# EAGLE design XBee_Shield (EAGLE 5.01)
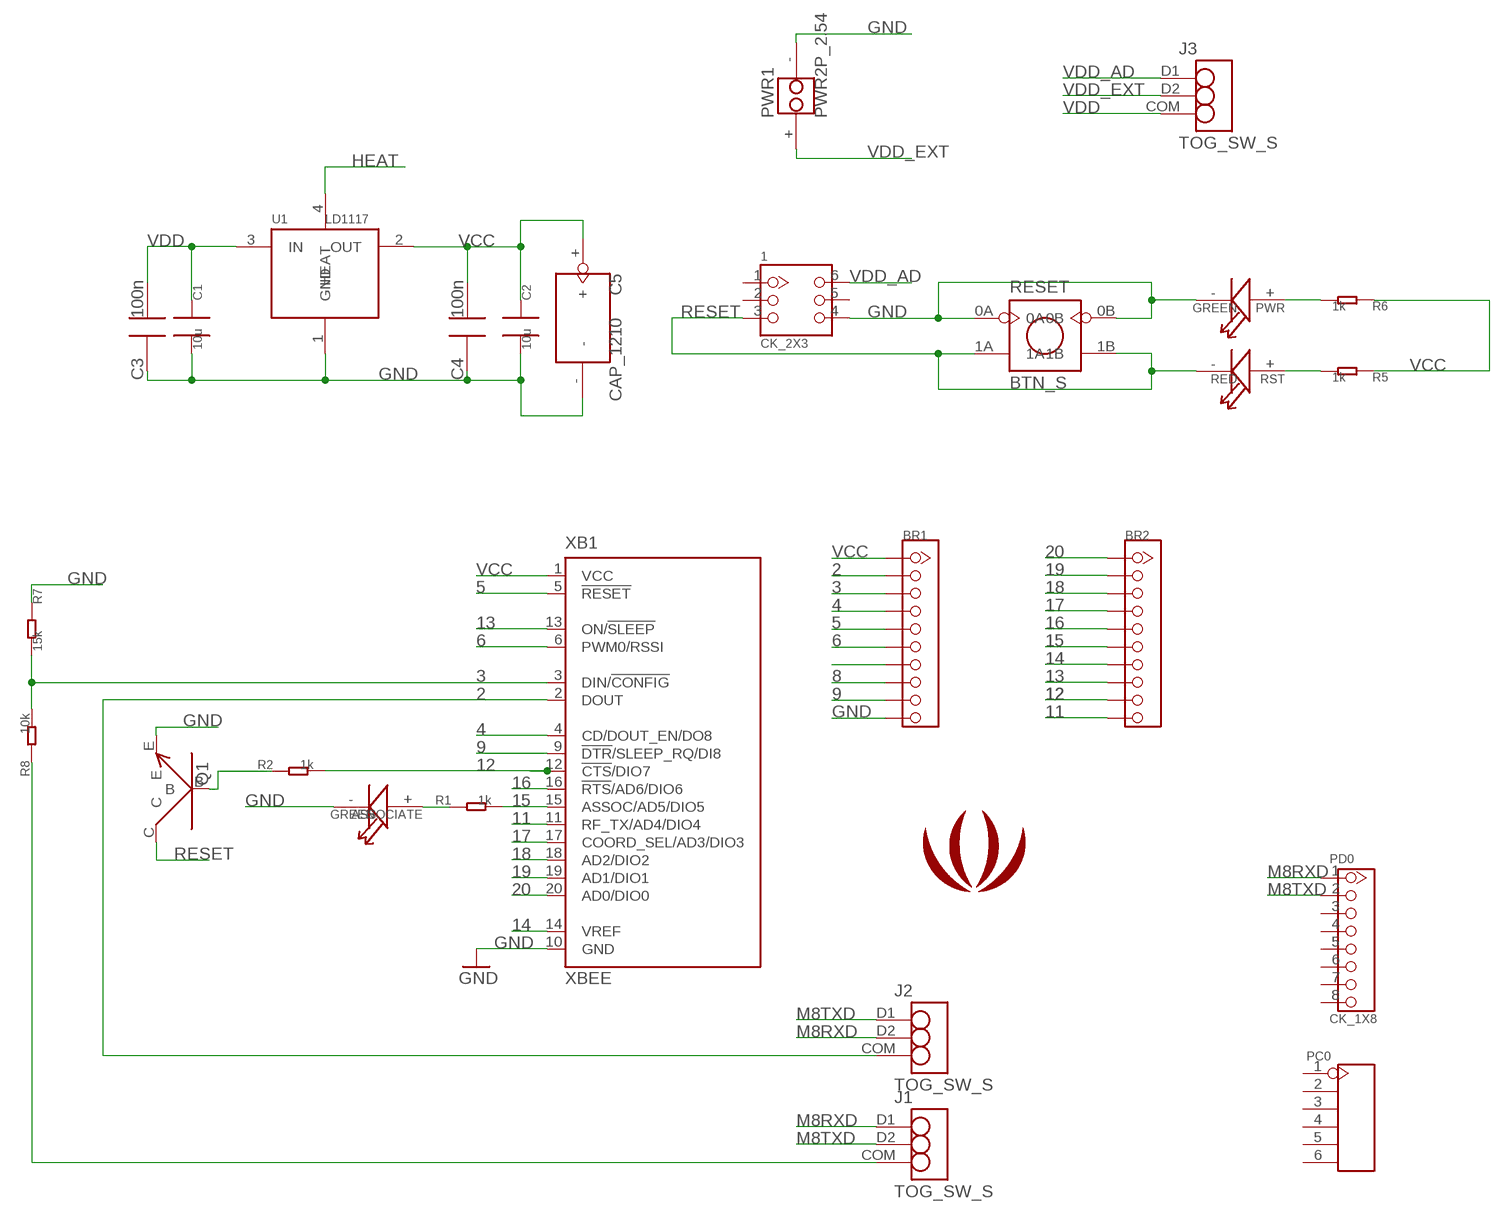
[diagram p0: schematic, sheet 1]

## Parts
1  CK_2X3  [CK_2X3]
ASSOCIATE  GREEN  LED0805  [LED0805]
BR1  CK1X10DD  [CK1X10]
BR2  CK1X10DD  [CK1X10]
C1  10u  C0805  [0805]
C2  10u  C0805  [0805]
C3  100n  C0603  [0603]
C4  100n  C0603  [0603]
C5  CAP_1210  [CAP_1210]
J1  TOG_SW_S  [TOG_SW_S]
J2  TOG_SW_S  [TOG_SW_S]
J3  TOG_SW_S  [TOG_SW_S]
PC0  CK_16  [CK_1*6]
PD0  CK_1X8  [CK_1X8]
PWR  GREEN  LED0805  [LED0805]
PWR1  PWR2P_2.54  [PWR2P_2.54]
Q1  NPN_9013  [SOT23]
R1  1k  R0603  [0603]
R2  1k  R0603  [0603]
R5  1k  R0603  [0603]
R6  1k  R0603  [0603]
R7  15k  R0603  [0603]
R8  10k  R0603  [0603]
RESET  BTN_S  [BTN_S]
RST  RED  LED0805  [LED0805]
U1  LD1117  [SOT223]
U$2  LOGO_COPPER150X124  [LOGO_COPPER_150X124]
XB1  XBEE  [XBEE]

## Nets
2: BR1.2 J2.COM XB1.2(DOUT)
3: BR1.3 R7.2 R8.2 XB1.3(DIN/!CONFIG)
4: BR1.4 XB1.4(CD/DOUT_EN/DO8)
5: BR1.5 XB1.5(!RESET)
6: BR1.6 XB1.6(PWM0/RSSI)
8: BR1.8
9: BR1.9 XB1.9(!DTR!/SLEEP_RQ/DI8)
11: BR2.10 XB1.11(RF_TX/AD4/DIO4)
12: BR2.9 R2.2 XB1.12(!CTS!/DIO7)
13: BR2.8 XB1.13(ON/!SLEEP)
14: BR2.7 XB1.14(VREF)
15: BR2.6 R1.2 XB1.15(ASSOC/AD5/DIO5)
16: BR2.5 XB1.16(!RTS!/AD6/DIO6)
17: BR2.4 XB1.17(COORD_SEL/AD3/DIO3)
18: BR2.3 XB1.18(AD2/DIO2)
19: BR2.2 XB1.19(AD1/DIO1)
20: BR2.1 XB1.20(AD0/DIO0)
GND [power]: 1.4 ASSOCIATE.- BR1.10 C1.2 C2.2 C3.1 C4.1 C5.- PWR1.- PWR.- Q1.E R7.1 RESET.0A RESET.0B U1.1(GND) XB1.10(GND)
HEAT: U1.4(HEAT)
M8RXD: J1.D1 J2.D2 PD0.1
M8TXD: J1.D2 J2.D1 PD0.2
N$1: ASSOCIATE.+ R1.1
N$2: PWR.+ R6.2
N$3: R5.2 RST.+
N$5: J1.COM R8.1
N$6: Q1.B R2.1
N$19: BR1.7
RESET: 1.3 Q1.C RESET.1A RESET.1B RST.-
VCC: BR1.1 C2.1 C4.2 C5.+ R5.1 R6.1 U1.2(OUT) XB1.1(VCC)
VDD [power]: C1.1 C3.2 J3.COM U1.3(IN)
VDD_AD [power]: 1.6 J3.D1
VDD_EXT [power]: J3.D2 PWR1.+
Unconnected: 1.1 1.2 1.5 PC0.1 PC0.2 PC0.3 PC0.4 PC0.5 PC0.6 PD0.3 PD0.4 PD0.5 PD0.6 PD0.7 PD0.8

## Library data of the parts
1 = CONNECTER:CK_2X3
ASSOCIATE PWR RST = CPT_SMD:LED0805
BR1 BR2 = CONNECTER:CK1X10
C1 C2 = CPT_SMD:C0805
C3 C4 = CPT_SMD:C0603; C0603: 100N
C5 = CPT_SMD:CAP_1210
J1-J3 = CPT_SMD:TOG_SW_S
PC0 = CONNECTER:CK_1*6
PD0 = CONNECTER:CK_1X8
PWR1 = CONNECTER:PWR2P_2.54
Q1 = CPT_SMD:NPN_9013
R1 R2 R5-R8 = CPT_SMD:R0603
RESET = CPT_SMD:BTN_S
U1 = ICs:LD1117
U$2 = logo:LOGO_COPPER
XB1 = EXT_moudle:XBEE: XBee (TM) /XBee-PRO(TM) OEM RF Modules Source: MaxStream, Inc. xbee_productmanual.pdf

## Net classes
0 default: clearance 0.203 mm
1 power: width 0.61 mm

## Board
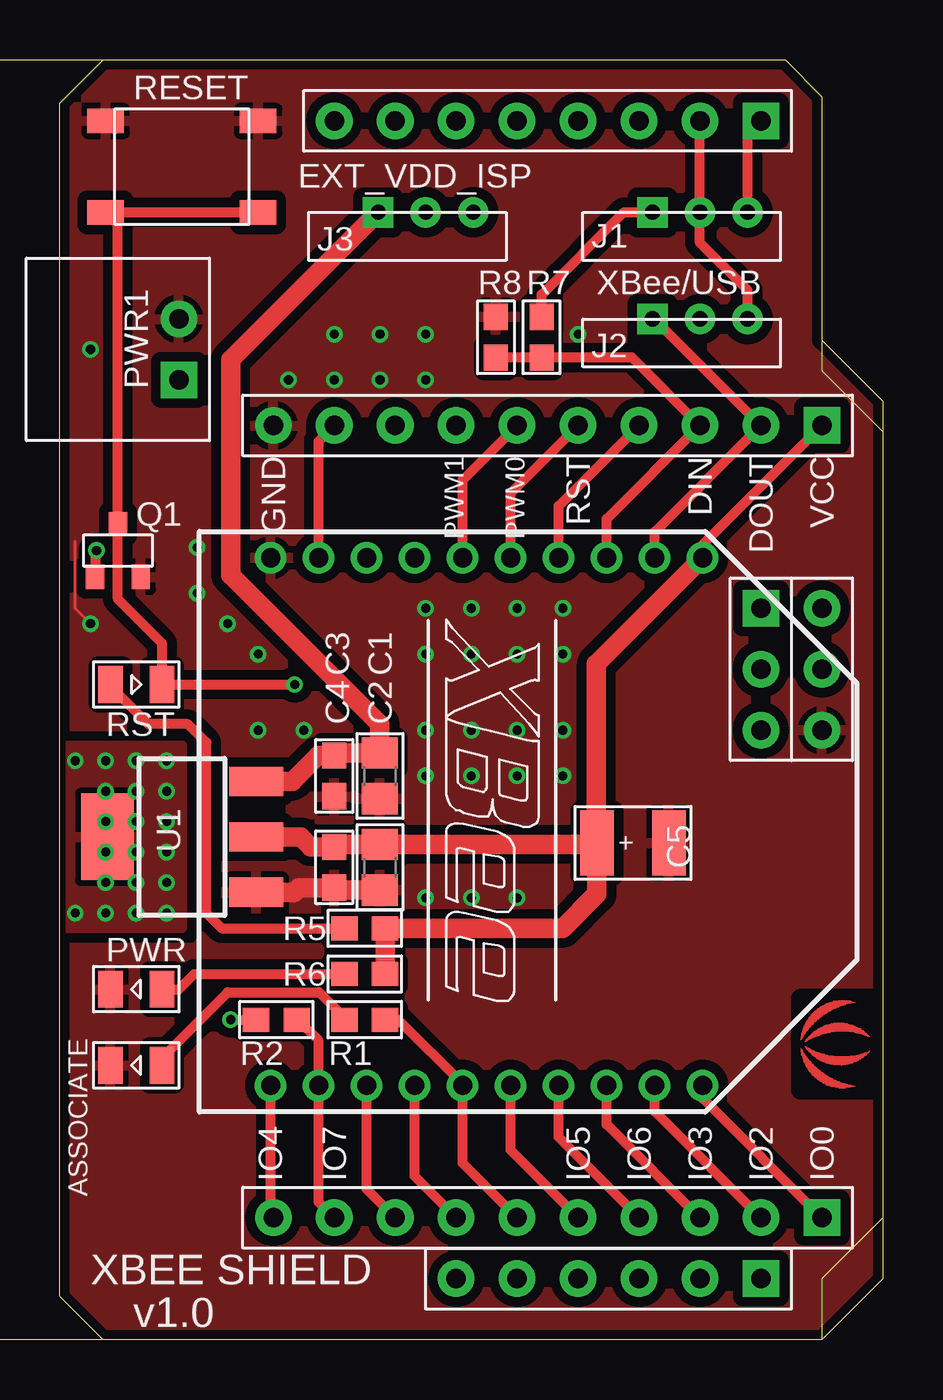
[diagram p1: board, top side]
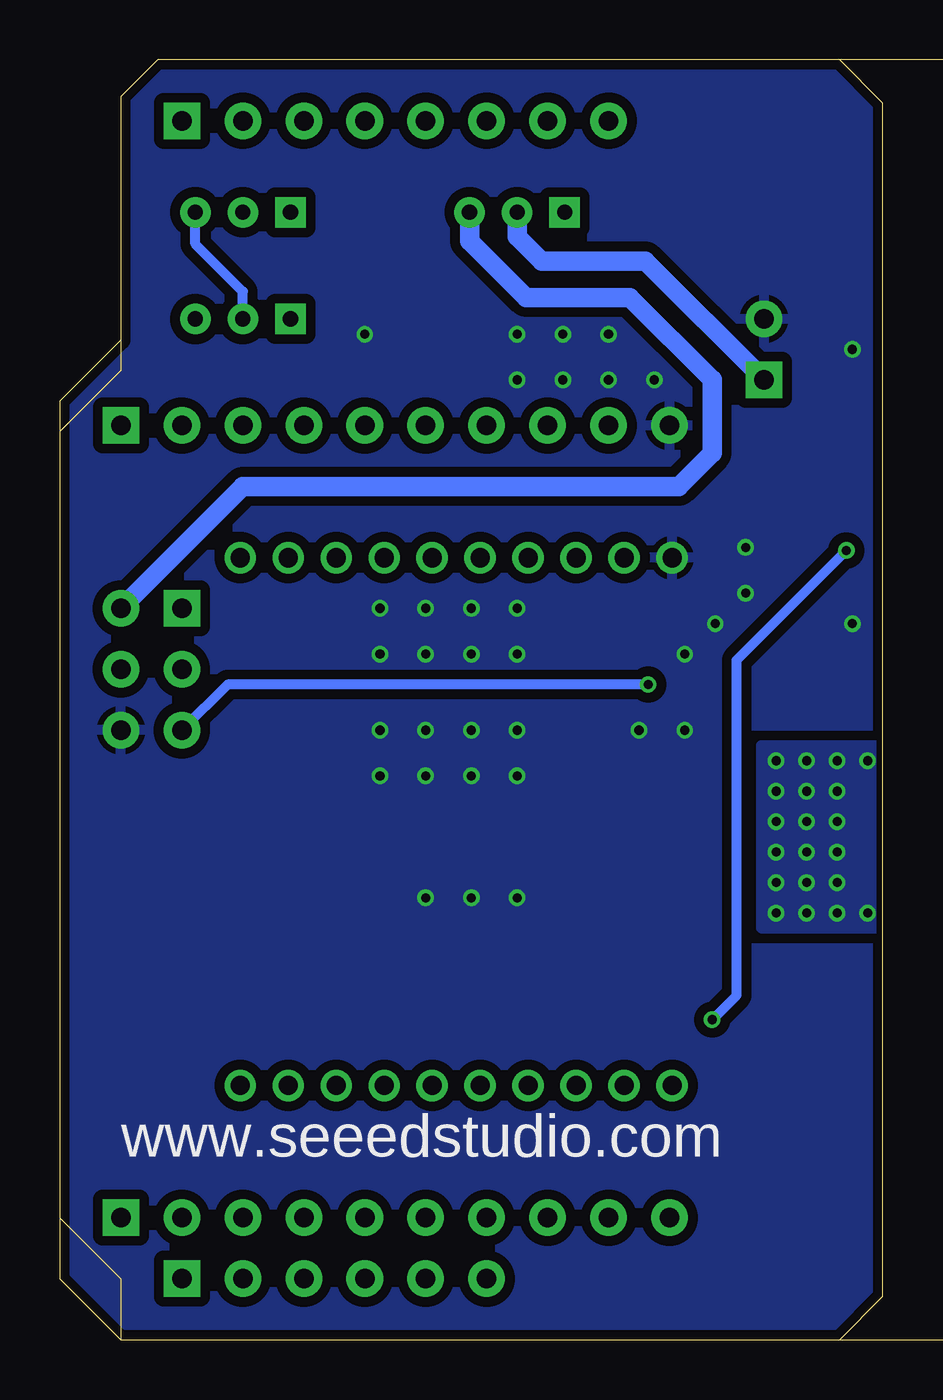
[diagram p2: board, bottom side, seen from below]

Size 34.29 x 53.34 mm. Coordinates in mm from the lower left corner, seen from the top.
Outline: 30.23,53.34 31.75,51.82 31.75,41.66 34.29,39.12 34.29,2.54 31.75,0 1.8,0 0,1.8 0,51.54 1.8,53.34 30.23,53.34
Copper layers (1*16): Top 0.035mm / dielectric 1.5mm / Bottom 0.035mm
Design rules "my rule_manufactory": minimum track width 0.1mm, minimum drill 0.3mm, track to track 6mil, track to pad 6mil, pad to pad 6mil, via to via 6mil, smd to smd 6mil, copper to edge 10mil, drill to drill 10mil, minimum pad ring 10mil, minimum via ring 6mil, stop-mask expansion 2mil, vias tented up to drill 100mil, thermal gap 10mil
tRestrict: area 30.9,10.4 to 33.8,14.2
Milling: 9 lines

### Footprints (pad centres in the part's own frame; a part is rotated, then mirrored left to right if it is on the bottom)
CK_2X3 = drill 0.813 pad 1.524 square: 1 -1.27,2.54 | drill 0.813 pad 1.524 round: 2 -1.27,0; 3 -1.27,-2.54; 4 1.27,-2.54; 5 1.27,0; 6 1.27,2.54
LED0805 = smd 1.016 x 1.524: + -1.077,0; - 1.077,0
CK1X10 = drill 0.813 pad 1.524 square: 1 0,11.43 | drill 0.813 pad 1.524 round: 2 0,8.89; 3 0,6.35; 4 0,3.81; 5 0,1.27; 6 0,-1.27; 7 0,-3.81; 8 0,-6.35; 9 0,-8.89; 10 0,-11.43
0805 = smd 1.3 x 1.5: 1 -0.95,0; 2 0.95,0
0603 = smd 1.1 x 1: 1 -0.85,0; 2 0.85,0
CAP_1210 = smd 1.4 x 2.7: + -1.5,0; - 1.5,0
TOG_SW_S = drill 0.635 pad 1.27 square: COM 0,-1.981 | drill 0.635 pad 1.27 round: D1 0,1.981; D2 0,0
CK_1*6 = drill 0.813 pad 1.524 square: 1 0,6.35 | drill 0.813 pad 1.524 round: 2 0,3.81; 3 0,1.27; 4 0,-1.27; 5 0,-3.81; 6 0,-6.35
CK_1X8 = drill 0.813 pad 1.524 square: 1 0,8.89 | drill 0.813 pad 1.524 round: 2 0,6.35; 3 0,3.81; 4 0,1.27; 5 0,-1.27; 6 0,-3.81; 7 0,-6.35; 8 0,-8.89
PWR2P_2.54 = drill 0.813 pad 1.524 square: + -1.27,0 | drill 0.813 pad 1.524 round: - 1.27,0
SOT23 = smd 0.762 x 1.016: B -0.95,-1.1; C 0,1.1; E 0.95,-1.1
BTN_S = smd 1.524 x 1.016: 0A -3.175,1.905; 0B 3.175,1.905; 1A -3.175,-1.905; 1B 3.175,-1.905
SOT223 = smd 1.219 x 2.235: 1 -2.311,-3.099; 2 0,-3.099; 3 2.311,-3.099 | smd 3.6 x 2.2: 4 0,3.099
XBEE = drill 0.8 pad 1.27 round: 1 -11,9; 2 -11,7; 3 -11,5; 4 -11,3; 5 -11,1; 6 -11,-1; 7 -11,-3; 8 -11,-5; 9 -11,-7; 10 -11,-9; 11 11,-9; 12 11,-7; 13 11,-5; 14 11,-3; 15 11,-1; 16 11,1; 17 11,3; 18 11,5; 19 11,7; 20 11,9

### Placement (x,y rotation side)
1  30.48,27.94 0 top
ASSOCIATE  3.17,11.43 180 top
BR1  20.32,38.1 270 top
BR2  20.32,5.08 270 top
C1  13.34,23.5 270 top
C2  13.34,19.68 270 top
C3  11.43,23.5 90 top
C4  11.43,19.68 90 top
C5  23.88,20.7 0 top
J1  26.67,46.99 270 top
J2  26.67,42.55 270 top
J3  15.24,46.99 270 top
PC0  22.86,2.54 270 top
PD0  20.32,50.8 270 top
PWR  3.17,14.61 180 top
PWR1  4.95,41.27 90 top
Q1  2.41,32.89 0 top
R1  12.7,13.34 0 top
R2  9.02,13.34 0 top
R5  12.7,17.14 180 top
R6  12.7,15.24 180 top
R7  18.16,41.78 270 top
R8  20.07,41.78 270 top
RESET  5.08,48.9 0 top
RST  3.17,27.3 0 top
U1  5.08,20.95 90 top
U$2  32,12.32 270 top
XB1  17.78,21.59 270 top

### Tracks (layer width: path | path; a pad name or v marks a point on that pad's centre or on a via)
2
  Top 0.406: XB1.2 24.78,33.67 BR1.2 24.77,42.55 J2.COM
3
  Top 0.406: R7.2 19.72,40.93 19.81,41.02 19.9,40.93 R8.2 23.84,40.93 BR1.3 22.78,34.21 XB1.3
4
  Top 0.406: XB1.4 20.78,34.75 BR1.4
5
  Top 0.406: XB1.5 18.78,35.29 BR1.5
6
  Top 0.406: XB1.6 16.78,35.83 BR1.6
9
  Top 0.406: XB1.9 10.78,37.45 BR1.9
11
  Top 0.406: XB1.11 8.78,5.19 BR2.10
12
  Top 0.406: BR2.9 10.78,5.73 XB1.12 10.78,12.46 9.91,13.34 R2.2
13
  Top 0.406: XB1.13 12.78,6.27 BR2.8
14
  Top 0.406: XB1.14 14.78,6.81 BR2.7
15
  Top 0.406: BR2.6 16.78,7.35 XB1.15 16.78,10.65 14.1,13.34 R1.2
16
  Top 0.406: XB1.16 18.78,7.89 BR2.5
17
  Top 0.406: XB1.17 20.78,8.43 BR2.4
18
  Top 0.406: XB1.18 22.78,8.97 BR2.3
19
  Top 0.406: XB1.19 24.78,9.51 BR2.2
20
  Top 0.406: XB1.20 26.78,10.05 BR2.1
GND  (via drill 0.38 pad 0.61)
  Top 0.076: v1.27,29.84 1.27,30.1
  Top 0.127: 0.63,33.27 0.63,30.48 v1.27,29.84
  Top 0.813: U1.1 9.75,18.64 9.95,18.84 C4.1 11.52,18.84 11.62,18.73 C2.2
  other vias: 19.05,18.41 17.14,18.41 10.16,25.4 8.25,25.4 8.25,28.57 6.98,29.84 5.71,31.11 5.71,33.02 20.95,23.5 19.05,23.5 17.14,23.5 15.24,23.5 15.24,25.4 17.14,25.4 19.05,25.4 20.95,25.4 20.95,28.57 19.05,28.57 17.14,28.57 15.24,28.57 15.24,30.48 17.14,30.48 19.05,30.48 20.95,30.48 15.24,40.01 13.34,40.01 11.43,40.01 9.52,40.01 11.43,41.91 13.34,41.91 15.24,41.91 21.59,41.91 15.24,18.41 1.27,41.27
  pour Top (isolate 0.406, rank 2): 31.75,42.55 34.29,40.01 34.29,2.54 31.75,0 1.8,0 0,1.8 0,51.54 1.8,53.34 31.75,53.34
  pour Bottom (isolate 0.406, rank 2): 31.75,42.55 34.29,40.01 34.29,2.54 31.75,0 1.8,0 0,1.8 0,51.54 1.8,53.34 31.75,53.34
HEAT  (via drill 0.38 pad 0.61)
  other vias: 0.63,24.13 1.91,24.13 3.17,24.13 4.45,24.13 4.45,22.86 3.17,22.86 1.91,22.86 1.91,21.59 3.17,21.59 4.45,21.59 4.45,20.32 3.17,20.32 1.91,20.32 1.91,19.05 3.17,19.05 4.45,19.05 4.45,17.78 3.17,17.78 1.91,17.78 0.63,17.78
  pour Top: 0,24.77 5.08,24.77 5.08,17.14 0,17.14
  pour Bottom (no thermals): 0,24.77 5.08,24.77 5.08,17.14 0,17.14
M8RXD
  Top 0.406: J1.D1 28.65,50.24 PD0.1
  Bottom 0.406: J1.D1 28.65,45.67 26.67,43.69 J2.D2
M8TXD
  Top 0.406: J2.D1 28.65,43.74 26.67,45.72 J1.D2 PD0.2
N$1
  Top 0.406: R1.1 11.85,13.42 10.79,14.48 6.98,14.48 4.25,11.74 ASSOCIATE.+
N$2
  Top 0.406: R6.2 5.59,15.24 4.95,14.61 PWR.+
N$3
  Top 0.406: R5.2 6.73,17.14 6.1,17.78 6.1,24.89 5.33,25.65 3.68,25.65 2.1,27.24 RST.+
N$5
  Top 0.406: J1.COM 23.49,46.99 20.07,43.56 R8.1
N$6  (via drill 0.38 pad 0.61)
  Top 0.406: v7.11,13.34 R2.1 | Q1.B 1.46,32.83 v1.52,32.89
  Bottom 0.406: v7.11,13.34 6.1,14.35 6.1,28.32 v1.52,32.89
RESET  (via drill 0.38 pad 0.61)
  Top 0.406: v9.78,27.3 RST.- 4.25,29.02 2.41,30.86 Q1.C 2.41,46.48 RESET.1A RESET.1B
  Bottom 0.406: 1.3 27.3,27.3 v9.78,27.3
VCC
  Top 0.406: XB1.1 26.78,33.13 BR1.1
  Top 0.813: U1.2 10.03,20.95 10.45,20.54 C4.2 11.43,20.57 11.49,20.64 C2.1 22.03,20.64 22.1,20.7 C5.+ | R6.1 13.55,16.85 13.59,16.89 13.55,16.93 R5.1 20.95,17.14 22.38,18.57 C5.+ | C5.+ 22.35,20.73 22.35,28.16 XB1.1
VDD
  Top 0.813: U1.3 9.68,23.27 10.76,24.34 C3.2 11.43,24.38 11.49,24.45 C1.1 13.34,25.65 7.11,31.88 7.11,40.84 J3.COM
VDD_AD
  Bottom 0.813: 1.6 26.67,35.56 8.51,35.56 7.11,36.96 7.11,40.01 10.54,43.43 14.86,43.43 17.22,45.8 J3.D1
VDD_EXT
  Bottom 0.813: PWR1.+ 9.91,44.96 14.22,44.96 15.24,45.97 J3.D2

### Text on the board
Top: top layer
Bottom: bottom layer
Dimension: boardoutline
tPlace: silktop | GND | PWM1 | PWM0 | RST | DOUT | VCC | IO4 | IO7 | IO5 | IO6 | IO3 | IO2 | IO0 | XBEE SHIELD | v1.0
bPlace: silkbottom | www.seeedstudio.com
tNames: EXT_VDD_ISP | XBee/USB | DIN
tStop: soldermask top
bStop: soldermask bottom
tCream: padmask top
bCream: padmask bottom
Drills: drill